# Altium schematic sheet BUCK_5v_TPS5430.SchDoc: Memristor Power 5.0
size A4; Author: Nikola Rašević; Organization: Memristor-Robotics; Address1: Vladimira Perića Valtera 2; Address2: 21000 Novi Sad; Address3: Serbia; Revision: v1
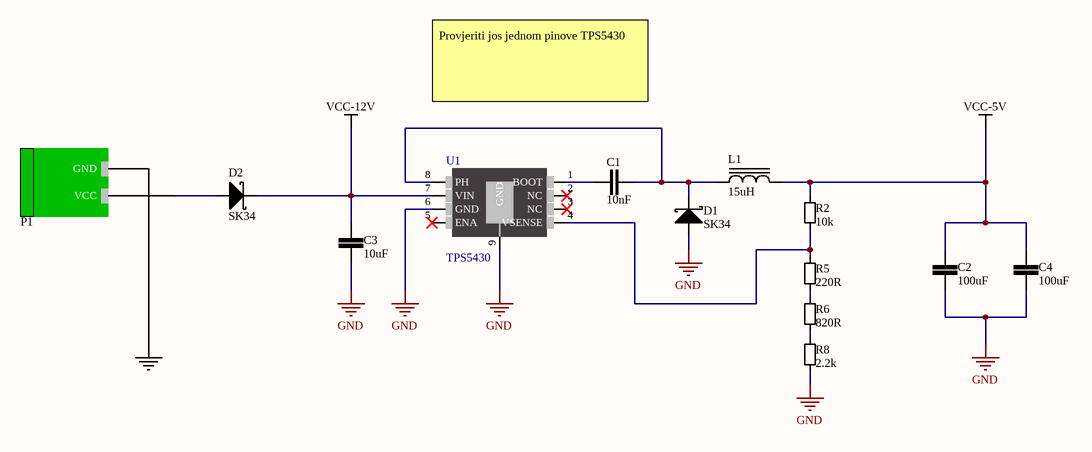
[diagram p0: BUCK_5v_TPS5430.SchDoc]

## Parts
C1  10nF  [CER_0805]
C2  100uF  [CER_1210]
C3  10uF  [CER_0805]
C4  100uF  [CER_1210]
D1  SK34  [DO214AC]
D2  SK34  [DO214AC]
L1  15uH  [INDUCTOR_SS1260-103MLD]
P1  2EDGRC-5.08-02P-14-00A(H)  [PWR_Con]  (value not drawn)
R2  10k  [RESC2013X38N-0805-NOOVERLAY]
R5  220R  [RESC2013X38N-0805-NOOVERLAY]
R6  820R  [RESC2013X38N-0805-NOOVERLAY]
R8  2.2k  [RESC2013X38N-0805-NOOVERLAY]
U1  TPS5430  [HSOP-8]

## Nets
GND: C2.1 C3.1 C4.1 D1.2(Anode) P1.1(GND) R8.1 U1.6(GND) U1.9(GND)
VCC-5V: C2.2 C4.2 L1.2 R2.2
VCC-12V: C3.2 D2.1(Cathode) U1.7(VIN)
NetC1_1: C1.1 U1.1(BOOT)
NetC1_2: C1.2 D1.1(Cathode) L1.1 U1.8(PH)
NetD2_2: D2.2(Anode) P1.2(VCC)
NetR2_1: R2.1 R5.2 U1.4(VSENSE)
NetR5_1: R5.1 R6.2
NetR6_1: R6.1 R8.2

Not connected (* = marked no-connect by the designer): U1 2(NC)* 3(NC)* 5(ENA)*

## Notes on the sheet
- Provjeriti jos jednom pinove TPS5430
- Title
- Date:
- Design Engineer:
- Time:
- Revision:
- Sheet
- of
- Size:
- A4
- www.memristor-robotics.io
- File:

## Library data of the parts
C1 = CER 10n 50V X7R: CAP CER 10n 50V X7R 10% 0805; Capacitance: 10nF; LCSC Part #: C1710
C2 C4 = 00002108: CAP CER 100u X5R 6.3V 10% 1210; Capacitance: 100uF
C3 = CER 10u 25V X5R: CAP CER 10u 25V X5R 10% 0805; Capacitance: 10uF; LCSC Part #: C15850
D1 D2 = SK34: DIODE SCHOTTKY 40V 3A DO214AC; Manufacturer: Vishay Semiconductor Diodes Division; Barcode: 0100000007488; id: 62; Assembly: SMD; Speed: Fast Recovery =< 500ns, > 200mA (Io); Voltage  Forward: 550mV @ 3A; item_id: 1025; Recommended Rating: Silver; Manufacturer Part Number: SK34; Category: Discrete Semiconductor Products; Datasheet URL: http://www.vishay.com/docs/88896/b330la.pdf; Package Case: DO-214AC, SMA; Family: DIODE; Voltage  DC Reverse: 40V; Current  Average Rectified: 3A; Diode Type: Schottky; Part Type: Discrete Semiconductors
L1 = IND_15uH: FIXED IND 15uH 3A; Assembly: SMD; Category: Inductors, Coils, Chokes; Inductance: 15uH; Current Rating: 3A; Family: INDUCTOR
P1 = 00000002: TERM BLOCK HDR 2POS 90DEG 5.08MM; Suplier: TME; Manufacturer Part Number: 2EDGRC-5.08-02P-14-00A(H); Suplier Product Link: https://www.tme.eu/en/details/2edgrc5.08-2p14/pluggable-terminal-blocks/degson-electronics/2edgrc-508-02p-14-00ah/; Price: 0.1304
R2 = 000001002: RES SMD 10 kOhm 1/8W 0805; Resistance: 10k
R5 = RES SMD 220 Ohm 0805: RES SMD 220 Ohm 1/8W 0805; Resistance: 220R; LCSC Part #: C17557
R6 = RES SMD 820 Ohm 0805: RES SMD 820 Ohm 1/8W 0805; Resistance: 820R; LCSC Part #: C17837
R8 = RES SMD 2.2 kOhm 0805: RES SMD 2.2 kOhm 1/8W 0805; Resistance: 2.2k; LCSC Part #: C17520
U1 = TPS5430: IC REG BUCK ADJ 3A 8SOPWRPAD; Manufacturer Part Number: TPS5430; LCSC Part #: C9864